# Altium schematic sheet FlipFlop.SchDoc
size A
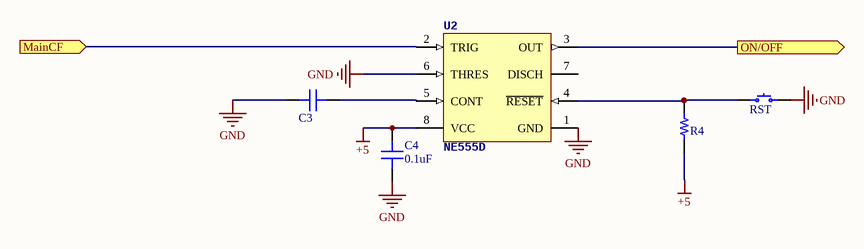
[diagram p0: FlipFlop.SchDoc]

## Parts
C3  10000pF  [CAP 0805/2012]  (value not drawn)
C4  0.1uF  [CAP 0805/2012]
R4  10k  [RES 1206/3216]  (value not drawn)
RST  AB11AH-HC  [NKK AB11AH-HC]  (value not drawn)
U2  NE555D  [D0008A_L]

## Ports
MainCF (in), ON/OFF (out)

## Nets
+5: C4.2 R4.2 U2.8(VCC)
GND: C3.1 C4.1 RST.3 U2.1(GND) U2.6(THRES)
MainCF: U2.2(TRIG) ; port MainCF
ON/OFF: U2.3(OUT) ; port ON/OFF
NetC3_2: C3.2 U2.5(CONT)
NetR4_1: R4.1 RST.1 U2.4(~{RESET})

Not connected (* = marked no-connect by the designer): U2 7(DISCH)

## Library data of the parts
C3 = CL21B103KAANNNC: CAP CER 10000PF 25V X7R 0805; Manufacturer: Samsung Electro-Mechanics America, Inc.; TemperatureRange: -55C ~ 125C; Tolerance: 10%; Value: 10000pF; Part Number: CL21B103KAANNNC; PartId: 5695; Supplier 1: Digi-Key; Supplier Part Number 1: 1276-2434-2-ND; ComponentLink1Description: Datasheet; ComponentLink1URL: http://www.samsungsem.com/kr/support/product-search/mlcc/CL21B103KAANNNC.jsp; ComponentLink2Description: Digi-Key listing; ComponentLink2URL: http://digikey.com/product-detail/en/CL21B103KAANNNC/1276-2434-2-ND/3888092; TemperatureCoefficient: X7R; Voltage: 25V; Price: 0.0081; Type: -; Device Package: 0805 (2012 Metric)
C4 = CL21B104KACNNNC: CAP CER 0.1UF 25V X7R 0805; Manufacturer: Samsung Electro-Mechanics America, Inc.; TemperatureRange: -55C ~ 125C; Tolerance: 10%; Value: 0.1uF; Part Number: CL21B104KACNNNC; PartId: 5699; Supplier 1: Digi-Key; Supplier Part Number 1: 1276-1099-2-ND; ComponentLink1Description: Datasheet; ComponentLink1URL: http://www.samsungsem.com/kr/support/product-search/mlcc/CL21B104KACNNNC.jsp; ComponentLink2Description: Digi-Key listing; ComponentLink2URL: http://digikey.com/product-detail/en/CL21B104KACNNNC/1276-1099-2-ND/3886757; TemperatureCoefficient: X7R; Voltage: 25V; Price: 0.0099; Device Package: 0805 (2012 Metric); Type: -
R4 = ERJ-8ENF1002V: RES SMD 10K OHM 1% 1/4W 1206; Manufacturer: Panasonic Electronic Components; TemperatureRange: -55C ~ 155C; TemperatureCoefficient: 100ppm/C; PowerRating: 0.25W, 1/4W; Value: 10k; Part Number: ERJ-8ENF1002V; PartId: 2956; Supplier 1: Digi-Key; Supplier Part Number 1: P10.0KFTR-ND; ComponentLink1Description: Datasheet; ComponentLink1URL: http://industrial.panasonic.com/www-cgi/jvcr13pz.cgi?E+PZ+3+AOA0002+ERJ8ENF1002V+7+WW; ComponentLink2Description: Digi-Key listing; ComponentLink2URL: http://digikey.com/product-detail/en/ERJ-8ENF1002V/P10.0KFTR-ND/89059; Tolerance: 1%; Price: 0.0093; Type: Thick Film; Device Package: 1206 (3216 Metric)
RST = AB11AH-HC: SWITCH PUSH SPST-NO 0.4VA 28V; Manufacturer: NKK Switches; Switch Function: Off-Mom; Actuator Type: Round, Button; Mechanical Life: 50,000 Cycles; Part Number: AB11AH-HC; PartId: 16763; Supplier 1: Digi-Key; Supplier Part Number 1: 360-2604-ND; ComponentLink1Description: Datasheet; ComponentLink1URL: http://2t70un3m1d9z1kztamkdrd38.wpengine.netdna-cdn.com/wp-content/uploads/2016/02/Apushbuttons-2.pdf; ComponentLink2Description: Digi-Key Listing; ComponentLink2URL: http://www.digikey.com/product-detail/en/nkk-switches/AB11AH-HC/360-2604-ND/1056046; Price: 5; TYPE: Standard; Series: AB; Circuit: SPST-NO; Illumination Voltage: -; Illumination Type, Colour: -; Operating Temperature: -30C ~ 85C
U2 = CMP-2000-06840-1: Precision Timer, 4.5 to 16 V, 0 to 70 degC, 8-Pin SOIC (D), Green (RoHS & no Sb/Br), Tube; PartNumber: NE555; Manufacturer: Texas Instruments; Base Number: 555; No. of Timers: 1; Supply Voltage Min: 4.5V; Operating Frequency Max: 0.5MHz; Supply Voltage Range: 4.5Vto16V; No. of Pins: 8; Supply Voltage Max: 16V; IC Temperature Range: Commercial; SVHC: NoSVHC(19-Dec-2012); Operating Mode: Astable,Monostable; Frequency: 500kHz; Package Description: 8-Pin Small Outline Integrated Circuit, Body 4.9 x 3.9 mm, Pitch 1.27 mm; Datasheet URL: http://www.ti.com/general/docs/lit/getliterature.tsp?genericPartNumber=NE555&fileType=pdf; Mounting Technology: SurfaceMount; Operating Temperature Range: 0°Cto+70°C; Operating Temperature Min: 0°C; Package URL: http://www.ti.com/lit/ml/msoi002j/msoi002j.pdf; Datasheet Version: Rev. I, 09/2014; Manufacturer URL: http://www.ti.com/; Digital IC Case Style: SOIC; Clock External Input: No; Logic Function Number: 555; IC Generic Number: 555; No. of Channels: 1; Operating Temperature Max: 70°C; Package / Case: SOIC; Package Reference: D8; Device Marking: NE555D